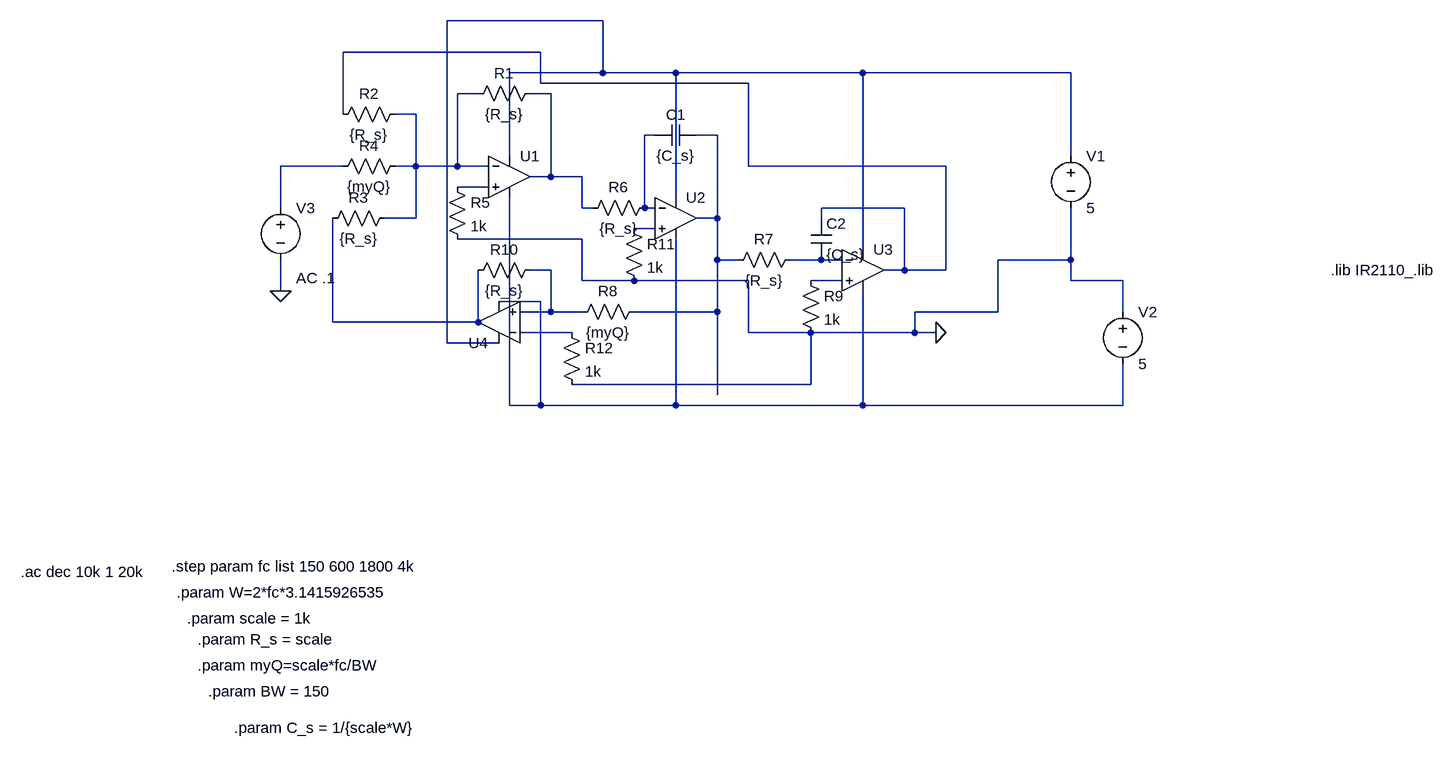
[diagram p0: schematic state_filter.asc]
state_filter.asc, the LTspice schematic file:
Version 4
SHEET 1 5188 3904
WIRE 304 -96 64 -96
WIRE 208 -48 -96 -48
WIRE 304 -16 304 -96
WIRE 304 -16 160 -16
WIRE 416 -16 304 -16
WIRE 704 -16 416 -16
WIRE 1024 -16 704 -16
WIRE 208 0 208 -48
WIRE 528 0 208 0
WIRE 112 16 80 16
WIRE 224 16 192 16
WIRE -96 48 -96 -48
WIRE 16 48 -16 48
WIRE 384 80 368 80
WIRE 480 80 448 80
WIRE 160 112 160 -16
WIRE 1024 112 1024 -16
WIRE -96 128 -192 128
WIRE 16 128 16 48
WIRE 16 128 -16 128
WIRE 80 128 80 16
WIRE 80 128 16 128
WIRE 128 128 80 128
WIRE 528 128 528 0
WIRE 832 128 528 128
WIRE 224 144 224 16
WIRE 224 144 192 144
WIRE 272 144 224 144
WIRE 128 160 80 160
WIRE 416 176 416 -16
WIRE -192 192 -192 128
WIRE 272 192 272 144
WIRE 288 192 272 192
WIRE 368 192 368 80
WIRE 384 192 368 192
WIRE 768 192 640 192
WIRE 16 208 16 128
WIRE 16 208 -32 208
WIRE 480 208 480 80
WIRE 480 208 448 208
WIRE 640 208 640 192
WIRE 384 224 352 224
WIRE 272 240 80 240
WIRE 704 256 704 -16
WIRE 480 272 480 208
WIRE 512 272 480 272
WIRE 640 272 592 272
WIRE 672 272 640 272
WIRE 1024 272 1024 192
WIRE 1024 272 912 272
WIRE 224 288 192 288
WIRE 768 288 768 192
WIRE 768 288 736 288
WIRE 832 288 832 128
WIRE 832 288 768 288
WIRE 272 304 272 240
WIRE 352 304 272 304
WIRE 528 304 352 304
WIRE 672 304 624 304
WIRE 1024 304 1024 272
WIRE 1104 304 1024 304
WIRE -192 320 -192 272
WIRE 208 336 144 336
WIRE 224 352 224 288
WIRE 224 352 176 352
WIRE 272 352 224 352
WIRE 480 352 480 272
WIRE 480 352 352 352
WIRE 912 352 912 272
WIRE 912 352 784 352
WIRE 1104 352 1104 304
WIRE -112 368 -112 208
WIRE 112 368 112 288
WIRE 112 368 -112 368
WIRE 256 384 176 384
WIRE 528 384 528 304
WIRE 624 384 528 384
WIRE 784 384 784 352
WIRE 784 384 624 384
WIRE 816 384 784 384
WIRE 64 400 64 -96
WIRE 144 400 64 400
WIRE 624 464 624 384
WIRE 624 464 256 464
WIRE 480 480 480 352
WIRE 160 496 160 176
WIRE 208 496 208 336
WIRE 208 496 160 496
WIRE 416 496 416 240
WIRE 416 496 208 496
WIRE 704 496 704 320
WIRE 704 496 416 496
WIRE 1104 496 1104 432
WIRE 1104 496 704 496
FLAG 816 384 0
FLAG -192 320 0
SYMBOL OpAmps\\UniversalOpAmp 160 144 R0
SYMATTR InstName U1
SYMBOL OpAmps\\UniversalOpAmp 416 208 R0
SYMATTR InstName U2
SYMBOL OpAmps\\UniversalOpAmp 704 288 R0
SYMATTR InstName U3
SYMBOL res 208 0 R90
WINDOW 0 0 56 VBottom 2
WINDOW 3 32 56 VTop 2
SYMATTR InstName R1
SYMATTR Value {R_s}
SYMBOL res 0 32 R90
WINDOW 0 0 56 VBottom 2
WINDOW 3 32 56 VTop 2
SYMATTR InstName R2
SYMATTR Value {R_s}
SYMBOL res -16 192 R90
WINDOW 0 0 56 VBottom 2
WINDOW 3 32 56 VTop 2
SYMATTR InstName R3
SYMATTR Value {R_s}
SYMBOL res 0 112 R90
WINDOW 0 0 56 VBottom 2
WINDOW 3 32 56 VTop 2
SYMATTR InstName R4
SYMATTR Value {myQ}
SYMBOL res 64 144 R0
SYMATTR InstName R5
SYMATTR Value 1k
SYMBOL res 384 176 R90
WINDOW 0 0 56 VBottom 2
WINDOW 3 32 56 VTop 2
SYMATTR InstName R6
SYMATTR Value {R_s}
SYMBOL res 608 256 R90
WINDOW 0 0 56 VBottom 2
WINDOW 3 32 56 VTop 2
SYMATTR InstName R7
SYMATTR Value {R_s}
SYMBOL cap 448 64 R90
WINDOW 0 0 32 VBottom 2
WINDOW 3 32 32 VTop 2
SYMATTR InstName C1
SYMATTR Value {C_s}
SYMBOL OpAmps\\UniversalOpAmp 144 368 R180
SYMATTR InstName U4
SYMBOL res 368 336 R90
WINDOW 0 0 56 VBottom 2
WINDOW 3 32 56 VTop 2
SYMATTR InstName R8
SYMATTR Value {myQ}
SYMBOL res 208 272 R90
WINDOW 0 0 56 VBottom 2
WINDOW 3 32 56 VTop 2
SYMATTR InstName R10
SYMATTR Value {R_s}
SYMBOL voltage 1024 96 R0
WINDOW 123 0 0 Left 0
WINDOW 39 0 0 Left 0
SYMATTR InstName V1
SYMATTR Value 5
SYMBOL res 608 288 R0
SYMATTR InstName R9
SYMATTR Value 1k
SYMBOL res 336 208 R0
SYMATTR InstName R11
SYMATTR Value 1k
SYMBOL voltage -192 176 R0
WINDOW 123 24 124 Left 2
WINDOW 39 0 0 Left 0
SYMATTR Value2 AC .1
SYMATTR InstName V3
SYMATTR Value ""
SYMBOL res 240 368 R0
SYMATTR InstName R12
SYMATTR Value 1k
SYMBOL voltage 1104 336 R0
WINDOW 123 0 0 Left 0
WINDOW 39 0 0 Left 0
SYMATTR InstName V2
SYMATTR Value 5
SYMBOL cap 624 208 R0
SYMATTR InstName C2
SYMATTR Value {C_s}
TEXT -592 752 Left 2 !.ac dec 10k 1 20k
TEXT -360 744 Left 2 !.step param fc list 150 600 1800 4k
TEXT -352 784 Left 2 !.param W=2*fc*3.1415926535
TEXT -336 824 Left 2 !.param scale = 1k
TEXT -320 856 Left 2 !.param R_s = scale
TEXT -320 896 Left 2 !.param myQ=scale*fc/BW
TEXT -304 936 Left 2 !.param BW = 150
TEXT -264 992 Left 2 !.param C_s = 1/{scale*W}
TEXT 1424 288 Left 2 !.lib IR2110_.lib

The netlist it stands for:
* state_filter.asc
XU1 N008 N003 N001 N013 N004 level1 Avol=1Meg GBW=10Meg Vos=0 En=0 Enk=0 In=0 Ink=0 Rin=500Meg  ; pins In+ In- V+ V- OUT
XU2 N009 N005 N001 N013 N006 level1 Avol=1Meg GBW=10Meg Vos=0 En=0 Enk=0 In=0 Ink=0 Rin=500Meg  ; pins In+ In- V+ V- OUT
XU3 N012 N010 N001 N013 N002 level1 Avol=1Meg GBW=10Meg Vos=0 En=0 Enk=0 In=0 Ink=0 Rin=500Meg  ; pins In+ In- V+ V- OUT
R1 N004 N003 {R_s}
R2 N003 N002 {R_s}
R3 N003 N014 {R_s}
R4 N003 N007 {myQ}
R5 N008 0 1k
R6 N005 N004 {R_s}
R7 N010 N006 {R_s}
C1 N006 N005 {C_s}
XU4 N011 N015 N001 N013 N014 level1 Avol=1Meg GBW=10Meg Vos=0 En=0 Enk=0 In=0 Ink=0 Rin=500Meg  ; pins In+ In- V+ V- OUT
R8 N006 N011 {myQ}
R10 N011 N014 {R_s}
V1 N001 0 5
R9 N012 0 1k
R11 N009 0 1k
V3 N007 0 AC .1
R12 N015 0 1k
V2 0 N013 5
C2 N002 N010 {C_s}
.ac dec 10k 1 20k
.step param fc list 150 600 1800 4k
.param W=2*fc*3.1415926535
.param scale = 1k
.param R_s = scale
.param myQ=scale*fc/BW
.param BW = 150
.param C_s = 1/{scale*W}
.lib IR2110_.lib
.lib UniversalOpAmp1.lib
.backanno
.end